# Altium project OCP2PCIe-H-F-4.PrjPcb
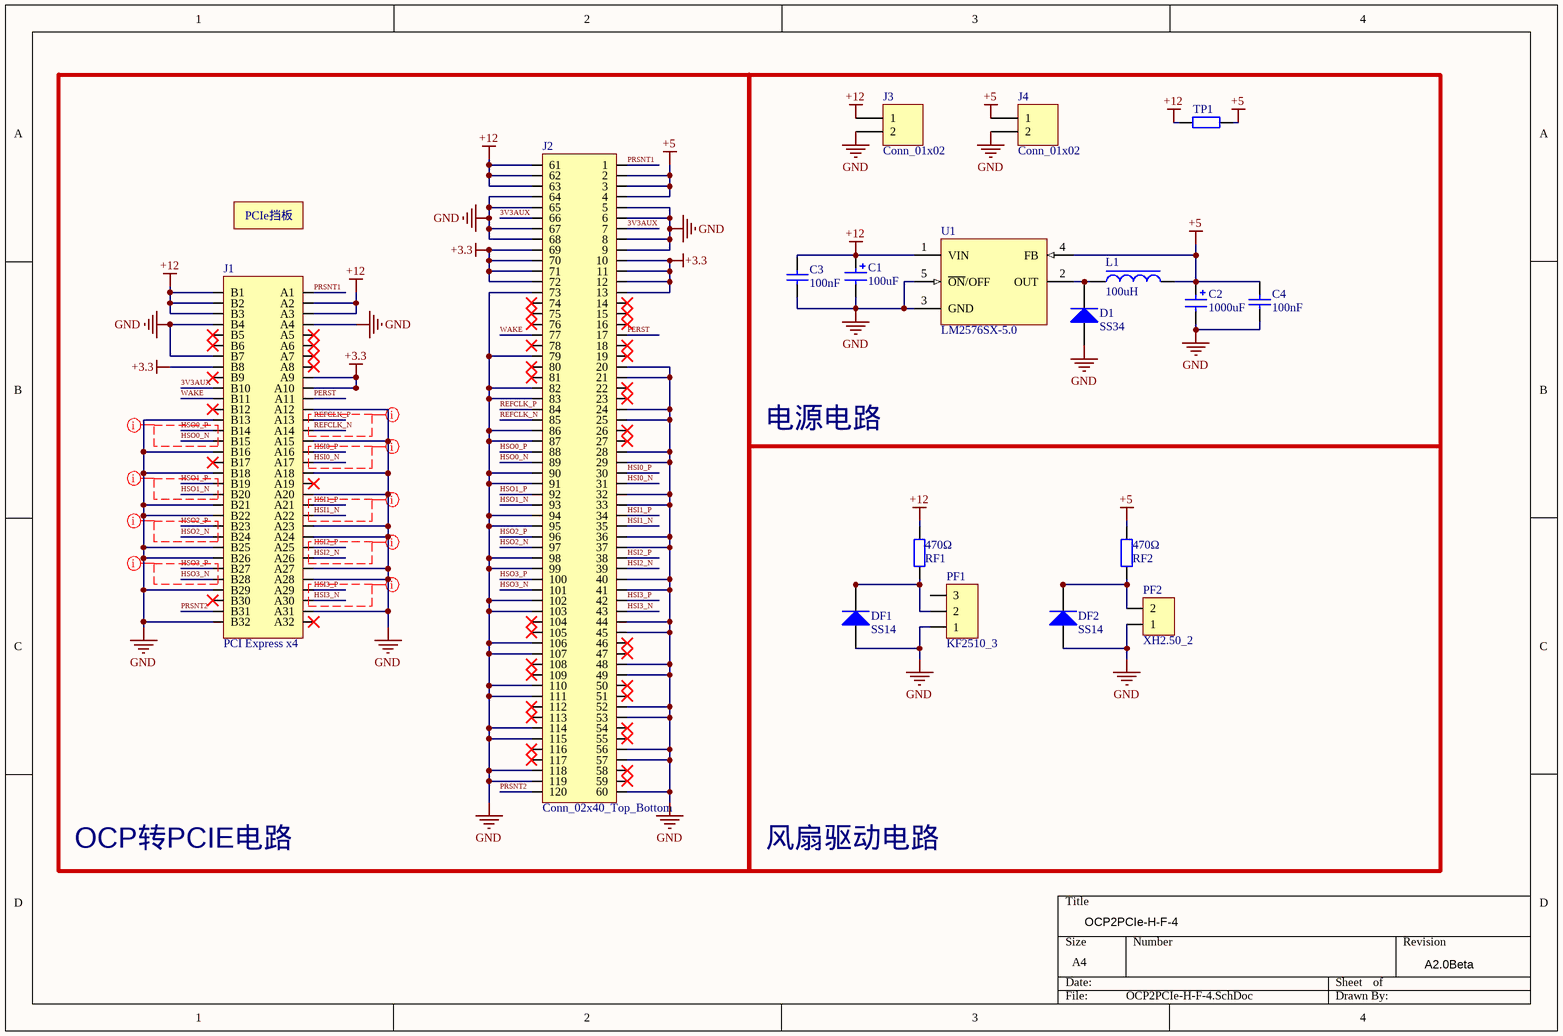
[diagram p0: OCP2PCIe-H-F-4.SchDoc]
1 sheet, 19 parts. Net scope: global (net labels, ports and power ports of the same name join across sheets).
Board file: OCP2PCIe-H-F-4.PcbDoc

## Sheet OCP2PCIe-H-F-4.SchDoc
size A4

### Parts
BEZEL  BEZEL  [BEZEL]  (value not drawn)
C1  100uF  [CAP-SMD_BD5.0-L5.3-W5.3-FD]
C2  1000uF  [CAP-SMD_BD10.0-L10.3-W10.3-FD]
C3  100nF  [0603_C]
C4  100nF  [0603_C]
D1  SS34  [SMA(DO-214AC)_S1]
DF1  SS14  [SMA(DO-214AC)_S1]
DF2  SS14  [SMA(DO-214AC)_S1]
J1  PCI Express x4  [PCI Express x4]
J2  Conn_02x40_Top_Bottom  [Conn_02x40_Top_Bottom]
J3  Conn_01x02  [Conn_01x02]
J4  Conn_01x02  [Conn_01x02]
L1  100uH  [SMD_5050]
PF1  KF2510_3  [CONN-KF_2510_3PIN]
PF2  XH2.50_2  [CONN-TH_P2.50_2Pin]
RF1  470Ω  [1206_R]
RF2  470Ω  [1206_R]
TP1  0Ω  [0805_R]  (value not drawn)
U1  LM2576SX-5.0  [TO-263-5]

### Blocks framed on the sheet
OCP转PCIE电路: BEZEL J1 J2
电源电路: C1-C4 D1 J3 J4 L1 TP1 U1

### Nets
+3.3: J1.A9 J1.A10 J1.B8 J2.10 J2.11 J2.12 J2.13 J2.69 J2.70 J2.71 J2.72
+5: C2.1 C4.2 J2.2 J2.3 J2.4 J4.1 L1.2 RF2.2 TP1.2 U1.4(FB)
+12: C1.1 C3.2 J1.A2 J1.A3 J1.B1 J1.B2 J1.B3 J2.61 J2.62 J2.63 J3.1 RF1.2 TP1.1 U1.1(VIN)
GND: C1.2 C2.2 C3.1 C4.1 D1.1(A) DF1.1(A) DF2.1(A) J1.A4 J1.A12 J1.A15 J1.A18 J1.A20 J1.A23 J1.A24 J1.A27 J1.A28 J1.A31 J1.B4 J1.B7 J1.B13 J1.B16 J1.B18 J1.B21 J1.B22 J1.B25 J1.B26 J1.B29 J1.B32 J2.5 J2.6 J2.8 J2.9 J2.20 J2.21 J2.24 J2.25 J2.28 J2.29 J2.32 J2.33 J2.36 J2.37 J2.40 J2.41 J2.44 J2.45 J2.48 J2.49 J2.52 J2.53 J2.56 J2.57 J2.60 J2.64 J2.65 J2.67 J2.68 J2.73 J2.79 J2.82 J2.83 J2.86 J2.87 J2.90 J2.91 J2.94 J2.95 J2.98 J2.99 J2.102 J2.103 J2.106 J2.107 J2.110 J2.111 J2.114 J2.115 J2.118 J2.119 J3.2 J4.2 PF1.1 PF2.1 U1.0(GND) U1.3(GND) U1.5(~{ON}/OFF)
3V3AUX: J1.B10 J2.7 J2.66
HSI0_N: J1.A17 J2.31
HSI0_P: J1.A16 J2.30
HSI1_N: J1.A22 J2.35
HSI1_P: J1.A21 J2.34
HSI2_N: J1.A26 J2.39
HSI2_P: J1.A25 J2.38
HSI3_N: J1.A30 J2.43
HSI3_P: J1.A29 J2.42
HSO0_N: J1.B15 J2.89
HSO0_P: J1.B14 J2.88
HSO1_N: J1.B20 J2.93
HSO1_P: J1.B19 J2.92
HSO2_N: J1.B24 J2.97
HSO2_P: J1.B23 J2.96
HSO3_N: J1.B28 J2.101
HSO3_P: J1.B27 J2.100
PERST: J1.A11 J2.17
PRSNT1: J1.A1 J2.1
PRSNT2: J1.B31 J2.120
REFCLK_N: J1.A14 J2.85
REFCLK_P: J1.A13 J2.84
WAKE: J1.B11 J2.77
NetD1_2: D1.2(K) L1.1 U1.2(OUT)
NetDF1_2: DF1.2(K) PF1.2 RF1.1
NetDF2_2: DF2.2(K) PF2.2 RF2.1

Not connected (* = marked no-connect by the designer): J1 A5* A6* A7* A8* A19* A32* B5* B6* B9* B12* B17* B30*; J2 14* 15* 16* 18* 19* 22* 23* 26* 27* 46* 47* 50* 51* 54* 55* 58* 59* 74* 75* 76* 78* 80* 81* 104* 105* 108* 109* 112* 113* 116* 117*; PF1 3

### Layout directives
net class PCIe; rule Width Constraint [Pref Width = 0.178mm    Min Width = 0.178mm    Max Width = 0.178mm]; rule Clearance Constraint [Clearance = 0.178mm]; rule Routing Via Style [Pref Size = 0.635mm    Pref Hole Size = 0.356mm]: HSI0_N, HSI0_P, HSI1_N, HSI1_P, HSI2_N, HSI2_P, HSI3_N, HSI3_P, HSO0_N, HSO0_P, HSO1_N, HSO1_P, HSO2_N, HSO2_P, HSO3_N, HSO3_P, REFCLK_N, REFCLK_P

### Notes on the sheet
- 风扇驱动电路
- OCP2PCIe-H-F-4
- A2.0Beta

### Library data of the parts
BEZEL = BEZEL: PCIe挡板
C1 C2 = 7343_CP: 贴片铝电解电容; ComponentLink1Description: 供应商链接; ComponentLink1URL: http://www.szlcsc.com/product/details_16815.html; Package: 3528; Supplier: LC; SuppliersPartNumber: C16133
C3 C4 = 0805 Cap: 贴片电容; ComponentLink1Description: 供应商链接; ComponentLink1URL: http://www.szlcsc.com/product/details_29074.html; Package: 0805; Supplier: LC; SuppliersPartNumber: C28323
D1 = SMA(DO-214AC) M7: 肖特基二极管; Notepad: 1N4007 4007 编号C2464 已经停售, 使用新物料编号C95872; ComponentLink1Description: 供应商链接; ComponentLink1URL: http://www.szlcsc.com/product/details_2841.html; Package: SMA(DO-214AC); Supplier: LC; SuppliersPartNumber: C95872
DF1 DF2 = SMA(DO-214AC) M7: 二极管; Notepad: 1N4007 4007 编号C2464 已经停售, 使用新物料编号C95872; ComponentLink1Description: 供应商链接; ComponentLink1URL: http://www.szlcsc.com/product/details_2841.html; Package: SMA(DO-214AC); Supplier: LC; SuppliersPartNumber: C95872
J1 = PCI Express x4: 插座-PCIe
J2 = Conn_02x40_Top_Bottom: 插座-0.8mm
J3 J4 = Conn_01x02: 插座-2.54mm; LatestRevisionDate: 17-Jul-2002; LatestRevisionNote: Re-released for DXP Platform.; Publisher: Altium Limited
L1 = SDM_Inductors: 贴片电感; ComponentLink1Description: 供应商链接; ComponentLink1URL: http://www.szlcsc.com/product/details_25303.html; Package: 0402; Supplier: LC; SuppliersPartNumber: C24563
PF1 = Conn_KF2510_3: 插座-KF2510-3; LatestRevisionDate: 17-Jul-2002; LatestRevisionNote: Re-released for DXP Platform.; Publisher: Altium Limited
PF2 = Conn_XH2.50_2: 插座-2.50mm; LatestRevisionDate: 17-Jul-2002; LatestRevisionNote: Re-released for DXP Platform.; Publisher: Altium Limited
RF1 RF2 = 1206_R: 贴片电阻; ComponentLink1Description: 供应商链接; ComponentLink1URL: http://www.szlcsc.com/product/details_18165.html; Package: 0805; Supplier: LC; SuppliersPartNumber: C17477
TP1 = 0805 0Ω (0R0) 1%: 贴片电阻; ComponentLink1Description: 供应商链接; ComponentLink1URL: http://www.szlcsc.com/product/details_18165.html; Package: 0805; Supplier: LC; SuppliersPartNumber: C17477
U1 = LM2576SX-5.0: DC-DC芯片; ComponentLink1Description: 供应商链接; ComponentLink1URL: http://www.szlcsc.com/product/details_35434.html; Package: TO-263-5; Supplier: LC; SuppliersPartNumber: C34465